# EAGLE schematic eTapper1main54 (EAGLE 8.5.2)
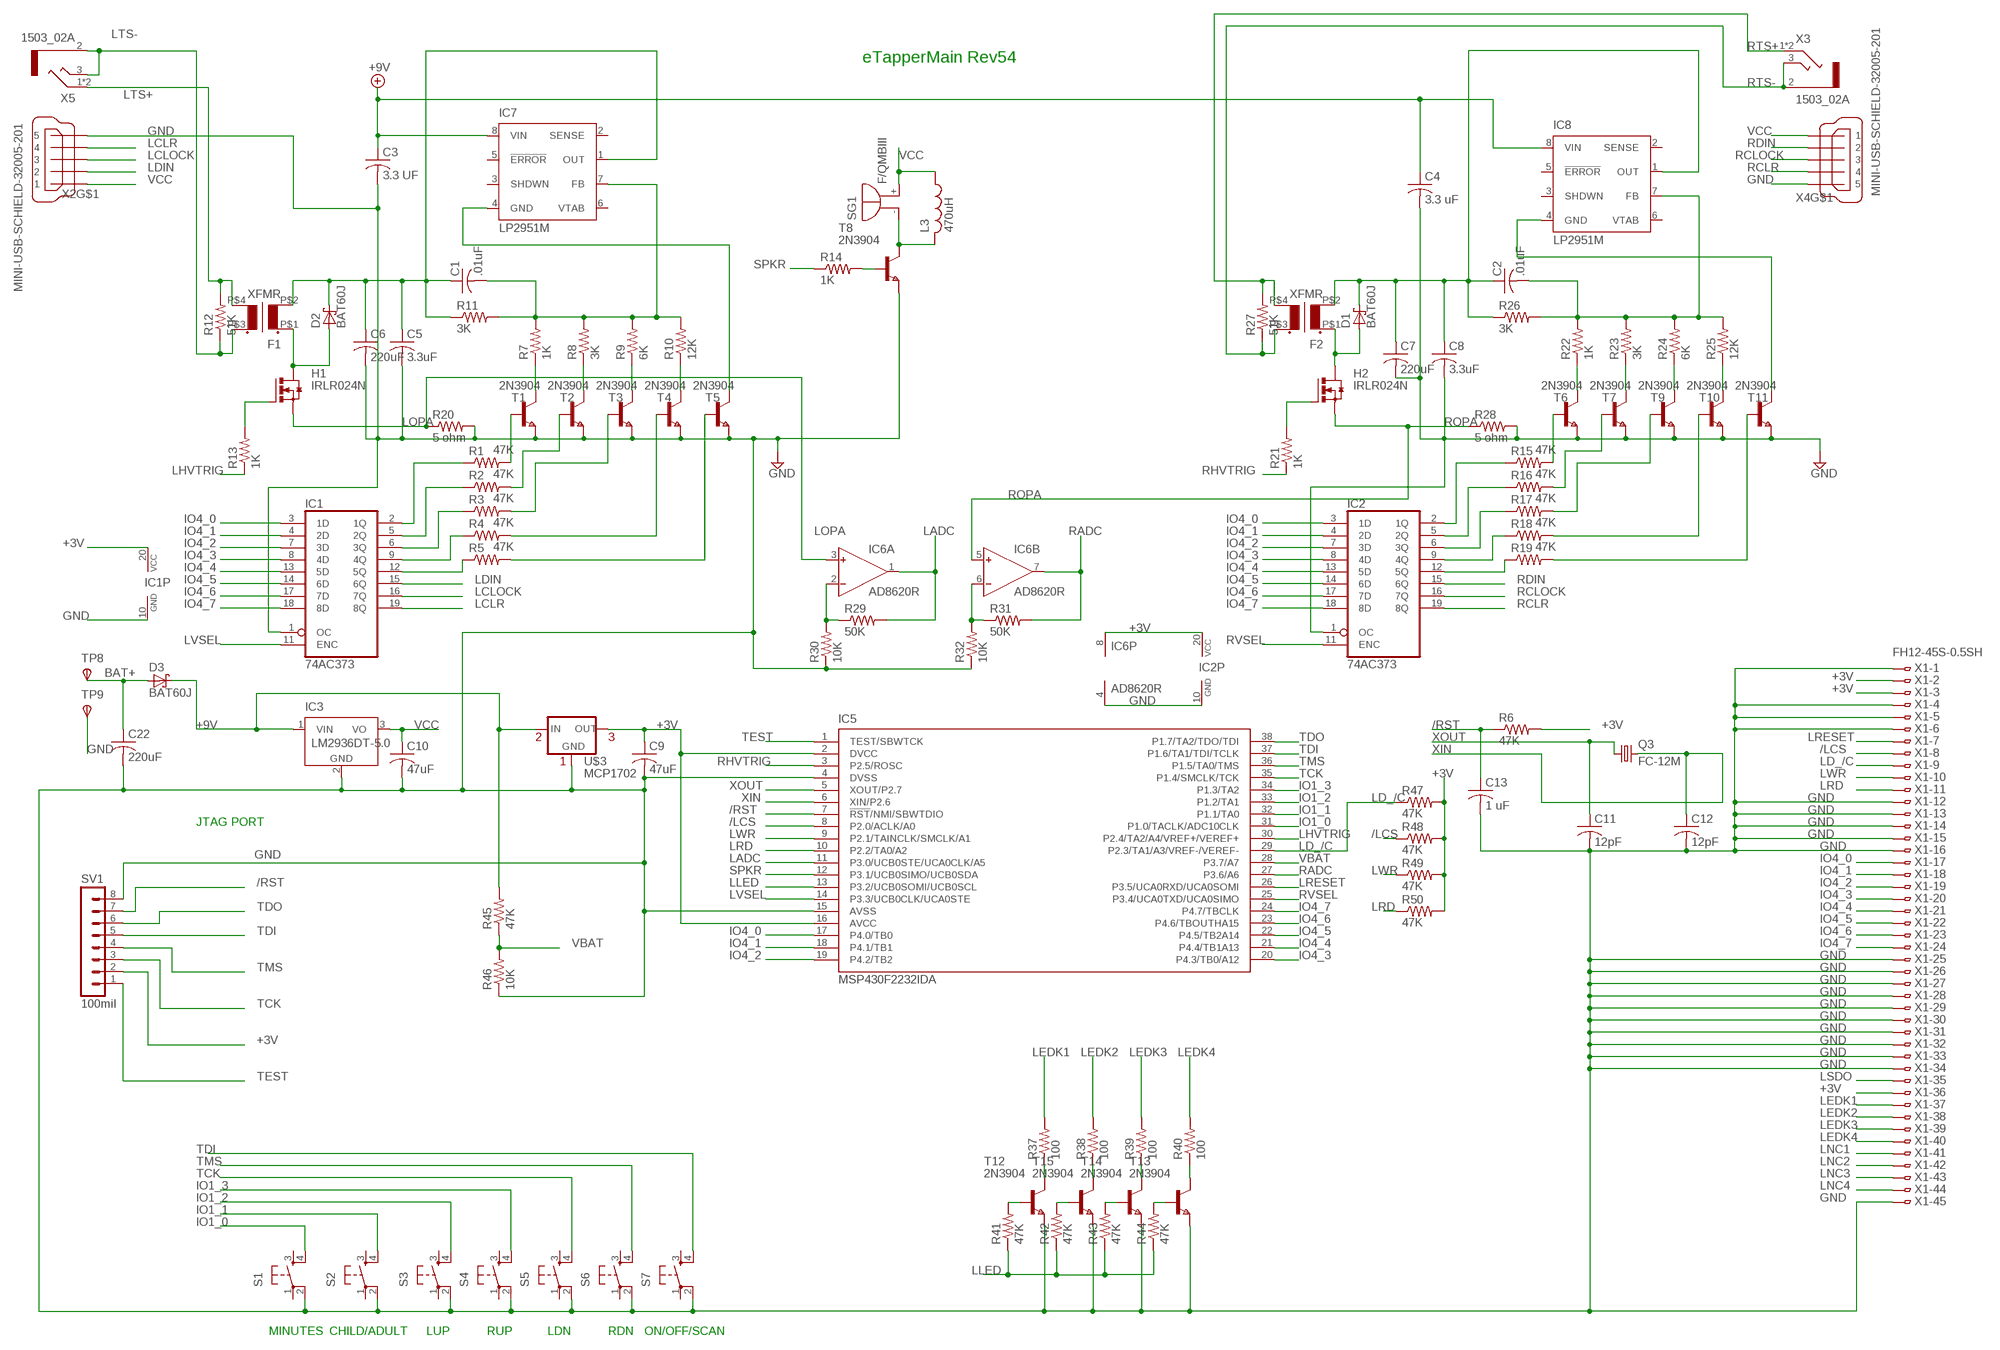
[diagram p0: schematic, sheet 1]

## Parts
C1  .01uF  C-USC0805  [C0805]
C2  .01uF  C-USC0805  [C0805]
C3  3.3 UF  C-USC1206  [C1206]
C4  3.3 uF  C-USC1206  [C1206]
C5  3.3uF  C-USC0805  [C0805]
C6  220uF  C-USC1206  [C1206]
C7  220uF  C-USC1206  [C1206]
C8  3.3uF  C-USC0805  [C0805]
C9  47uF  C-USC1206  [C1206]
C10  47uF  C-USC1206  [C1206]
C11  12pF  C-USC0805  [C0805]
C12  12pF  C-USC0805  [C0805]
C13  1 uF  C-USC0805  [C0805]
C22  220uF  C-USC1206  [C1206]
D1  BAT60J  [SOD323_ST]
D2  BAT60J  [SOD323_ST]
D3  BAT60J  [SOD323_ST]
F1  XFMR  [XFMR]
F2  XFMR  [XFMR]
H1  IRLR024N  [D-PAK_TO252AA]
H2  IRLR024N  [D-PAK_TO252AA]
IC1  74AC373  [SO20]
IC2  74AC373  [SO20]
IC3  LM2936DT-5.0  [TO252]
IC5  MSP430F2232IDA  [TSSOP38_R-PDSO-G38-DA]
IC6  AD8620R  [SO8]
IC7  LP2951M  [SO08]
IC8  LP2951M  [SO08]
L3  470uH  L-USL2825P  [L2825P]
Q3  FC-12M  [FC-12M]
R1  47K  R-US_R0603  [R0603]
R2  47K  R-US_R0603  [R0603]
R3  47K  R-US_R0603  [R0603]
R4  47K  R-US_R0603  [R0603]
R5  47K  R-US_R0603  [R0603]
R6  47K  R-US_R0603  [R0603]
R7  1K  R-US_R0603  [R0603]
R8  3K  R-US_R0603  [R0603]
R9  6K  R-US_R0603  [R0603]
R10  12K  R-US_R0603  [R0603]
R11  3K  R-US_R0603  [R0603]
R12  51K  R-US_R0603  [R0603]
R13  1K  R-US_R0603  [R0603]
R14  1K  R-US_R0603  [R0603]
R15  47K  R-US_R0603  [R0603]
R16  47K  R-US_R0603  [R0603]
R17  47K  R-US_R0603  [R0603]
R18  47K  R-US_R0603  [R0603]
R19  47K  R-US_R0603  [R0603]
R20  5 ohm  R-US_R0603  [R0603]
R21  1K  R-US_R0603  [R0603]
R22  1K  R-US_R0603  [R0603]
R23  3K  R-US_R0603  [R0603]
R24  6K  R-US_R0603  [R0603]
R25  12K  R-US_R0603  [R0603]
R26  3K  R-US_R0603  [R0603]
R27  51K  R-US_R0603  [R0603]
R28  5 ohm  R-US_R0603  [R0603]
R29  50K  R-US_R0603  [R0603]
R30  10K  R-US_R0603  [R0603]
R31  50K  R-US_R0603  [R0603]
R32  10K  R-US_R0603  [R0603]
R37  100  R-US_R0603  [R0603]
R38  100  R-US_R0603  [R0603]
R39  100  R-US_R0603  [R0603]
R40  100  R-US_R0603  [R0603]
R41  47K  R-US_R0603  [R0603]
R42  47K  R-US_R0603  [R0603]
R43  47K  R-US_R0603  [R0603]
R44  47K  R-US_R0603  [R0603]
R45  47K  R-US_R0603  [R0603]
R46  10K  R-US_R0603  [R0603]
R47  47K  R-US_R0603  [R0603]
R48  47K  R-US_R0603  [R0603]
R49  47K  R-US_R0603  [R0603]
R50  47K  R-US_R0603  [R0603]
S1  10-XX  [B3F-10XX]
S2  10-XX  [B3F-10XX]
S3  10-XX  [B3F-10XX]
S4  10-XX  [B3F-10XX]
S5  10-XX  [B3F-10XX]
S6  10-XX  [B3F-10XX]
S7  10-XX  [B3F-10XX]
SG1  F/QMBIII  [F/QMBIII]
SV1  100mil  MA08-1  [MA08-1]
T1  2N3904  NPNSOT23  [SOT-23]
T2  2N3904  NPNSOT23  [SOT-23]
T3  2N3904  NPNSOT23  [SOT-23]
T4  2N3904  NPNSOT23  [SOT-23]
T5  2N3904  NPNSOT23  [SOT-23]
T6  2N3904  NPNSOT23  [SOT-23]
T7  2N3904  NPNSOT23  [SOT-23]
T8  2N3904  NPNSOT23  [SOT-23]
T9  2N3904  NPNSOT23  [SOT-23]
T10  2N3904  NPNSOT23  [SOT-23]
T11  2N3904  NPNSOT23  [SOT-23]
T12  2N3904  NPNSOT23  [SOT-23]
T13  2N3904  NPNSOT23  [SOT-23]
T14  2N3904  NPNSOT23  [SOT-23]
T15  2N3904  NPNSOT23  [SOT-23]
TP8  TPSPAD1-20  [P1-20]
TP9  TPSPAD1-20  [P1-20]
U$3  MCP1702  [TO92-]
X1  FH12-45S-0.5SH  [FH12-45S-0.5SH]
X2  MINI-USB-SCHIELD-32005-201  [32005-201]
X3  1503_02A  [1503_02]
X4  MINI-USB-SCHIELD-32005-201  [32005-201]
X5  1503_02A  [1503_02]

## Nets
+3V [+3V]: C9.1 IC1.20(VCC) IC2.20(VCC) IC5.2(DVCC) IC5.16(AVCC) IC6.8(P:V+) R6.2 R47.2 R48.2 R49.2 R50.2 SV1.2 U$3.3(OUT) X1.2 X1.3 X1.36
+9V [+9V]: C3.1 C4.1 D3.C IC3.1(VIN) IC7.8(VIN) IC8.8(VIN) R45.2 U$3.2(IN)
/LCS: IC5.8(P2.0/ACLK/A0) R48.1 X1.8
/RST: C13.1 IC5.7(!RST!/NMI/SBWTDIO) R6.1 SV1.7
BAT+ [BAT+]: C22.1 D3.A TP8.TP(PP)
GND [GND]: C3.2 C4.2 C5.2 C6.2 C7.2 C8.2 C9.2 C10.2 C11.2 C12.2 C13.2 C22.2 IC1.1(OC) IC1.10(GND) IC2.1(OC) IC2.10(GND) IC3.2(GND) IC5.4(DVSS) IC5.15(AVSS) IC6.4(P:V-) R20.2 R28.2 R30.1 R32.1 R46.1 S1.2(P1) S2.2(P1) S3.2(P1) S4.2(P1) S5.2(P1) S6.2(P1) S7.2(P1) SV1.8 T1.2(E) T2.2(E) T3.2(E) T4.2(E) T5.2(E) T6.2(E) T7.2(E) T8.2(E) T9.2(E) T10.2(E) T11.2(E) T12.2(E) T13.2(E) T14.2(E) T15.2(E) TP9.TP(PP) U$3.1(GND) X1.1 X1.4 X1.5 X1.6 X1.12 X1.13 X1.14 X1.15 X1.16 X1.25 X1.26 X1.27 X1.28 X1.29 X1.30 X1.31 X1.32 X1.33 X1.34 X1.45 X2.5 X4.5
IO1_0: IC5.31(P1.0/TACLK/ADC10CLK) S1.4(S1)
IO1_1: IC5.32(P1.1/TA0) S2.4(S1)
IO1_2: IC5.33(P1.2/TA1) S3.4(S1)
IO1_3: IC5.34(P1.3/TA2) S4.4(S1)
IO4_0: IC1.3(1D) IC2.3(1D) IC5.17(P4.0/TB0) X1.17
IO4_1: IC1.4(2D) IC2.4(2D) IC5.18(P4.1/TB1) X1.18
IO4_2: IC1.7(3D) IC2.7(3D) IC5.19(P4.2/TB2) X1.19
IO4_3: IC1.8(4D) IC2.8(4D) IC5.20(P4.3/TB0/A12) X1.20
IO4_4: IC1.13(5D) IC2.13(5D) IC5.21(P4.4/TB1A13) X1.21
IO4_5: IC1.14(6D) IC2.14(6D) IC5.22(P4.5/TB2A14) X1.22
IO4_6: IC1.17(7D) IC2.17(7D) IC5.23(P4.6/TBOUTHA15) X1.23
IO4_7: IC1.18(8D) IC2.18(8D) IC5.24(P4.7/TBCLK) X1.24
LADC: IC5.11(P3.0/UCB0STE/UCA0CLK/A5) IC6.1(A:OUT) R29.2
LCLOCK: IC1.16(7Q) X2.3
LCLR: IC1.19(8Q) X2.4
LD_/C: IC5.29(P2.3/TA1/A3/VREF-/VEREF-) R47.1 X1.9
LDIN: IC1.15(6Q) X2.2
LEDK1: R37.2 X1.37
LEDK2: R38.2 X1.38
LEDK3: R39.2 X1.39
LEDK4: R40.2 X1.40
LHVTRIG: IC5.30(P2.4/TA2/A4/VREF+/VEREF+) R13.1
LLED: IC5.13(P3.2/UCB0SOMI/UCB0SCL) R41.1 R42.1 R43.1 R44.1
LNC1: X1.41
LNC2: X1.42
LNC3: X1.43
LNC4: X1.44
LOPA: H1.3(S) IC6.3(A:IN+) R20.1
LRD: IC5.10(P2.2/TA0/A2) R50.1 X1.11
LRESET: IC5.26(P3.5/UCA0RXD/UCA0SOMI) X1.7
LSDO: X1.35
LTS+: F1.P$4(S2) R12.2 X5.1 X5.4
LTS-: F1.P$3(S1) R12.1 X5.2 X5.3
LVSEL: IC1.11(ENC) IC5.14(P3.3/UCB0CLK/UCA0STE)
LWR: IC5.9(P2.1/TAINCLK/SMCLK/A1) R49.1 X1.10
N$1: IC1.2(1Q) R1.1
N$2: IC1.5(2Q) R2.1
N$3: IC1.6(3Q) R3.1
N$4: IC1.9(4Q) R4.1
N$5: IC1.12(5Q) R5.1
N$6: L3.2 SG1.-(+) T8.1(C)
N$7: R4.2 T4.3(B)
N$8: R5.2 T5.3(B)
N$9: D2.A F1.P$1(P1) H1.4(D)
N$10: R7.1 T1.1(C)
N$11: R8.1 T2.1(C)
N$12: R9.1 T3.1(C)
N$13: R1.2 T1.3(B)
N$14: R2.2 T2.3(B)
N$15: R3.2 T3.3(B)
N$16: R10.1 T4.1(C)
N$17: C1.2 IC7.7(FB) R7.2 R8.2 R9.2 R10.2 R11.2
N$18: C1.1 C5.1 C6.1 D2.C F1.P$2(P2) IC7.1(OUT) R11.1
N$19: D1.A F2.P$1(P1) H2.4(D)
N$20: IC2.2(1Q) R15.1
N$21: H1.1(G) R13.2
N$22: R14.2 T8.3(B)
N$24: IC2.5(2Q) R16.1
N$25: IC2.6(3Q) R17.1
N$26: IC2.9(4Q) R18.1
N$27: IC2.12(5Q) R19.1
N$28: R44.2 T13.3(B)
N$29: R15.2 T6.3(B)
N$30: R16.2 T7.3(B)
N$31: R17.2 T9.3(B)
N$32: R18.2 T10.3(B)
N$33: R19.2 T11.3(B)
N$35: R22.1 T6.1(C)
N$36: R23.1 T7.1(C)
N$37: R24.1 T9.1(C)
N$38: R25.1 T10.1(C)
N$39: C2.2 IC8.7(FB) R22.2 R23.2 R24.2 R25.2 R26.2
N$40: C2.1 C7.1 C8.1 D1.C F2.P$2(P2) IC8.1(OUT) R26.1
N$41: R37.1 T12.1(C)
N$42: H2.1(G) R21.2
N$43: R38.1 T15.1(C)
N$44: R39.1 T14.1(C)
N$45: IC7.4(GND) T5.1(C)
N$46: R40.1 T13.1(C)
N$47: IC8.4(GND) T11.1(C)
N$48: R43.2 T14.3(B)
N$49: R41.2 T12.3(B)
N$50: R42.2 T15.3(B)
N$52: IC6.6(B:IN-) R31.1 R32.2
N$54: IC6.2(A:IN-) R29.1 R30.2
RADC: IC5.27(P3.6/A6) IC6.7(B:OUT) R31.2
RCLOCK: IC2.16(7Q) X4.3
RCLR: IC2.19(8Q) X4.4
RDIN: IC2.15(6Q) X4.2
RHVTRIG: IC5.3(P2.5/ROSC) R21.1
ROPA: H2.3(S) IC6.5(B:IN+) R28.1
RTS+: F2.P$4(S2) R27.2 X3.1 X3.4
RTS-: F2.P$3(S1) R27.1 X3.2 X3.3
RVSEL: IC2.11(ENC) IC5.25(P3.4/UCA0TXD/UCA0SIMO)
SPKR: IC5.12(P3.1/UCB0SIMO/UCB0SDA) R14.1
TCK: IC5.35(P1.4/SMCLK/TCK) S5.4(S1) SV1.3
TDI: IC5.37(P1.6/TA1/TDI/TCLK) S7.4(S1) SV1.5
TDO: IC5.38(P1.7/TA2/TDO/TDI) SV1.6
TEST: IC5.1(TEST/SBWTCK) SV1.1
TMS: IC5.36(P1.5/TA0/TMS) S6.4(S1) SV1.4
VBAT: IC5.28(P3.7/A7) R45.1 R46.2
VCC [VCC]: C10.1 IC3.3(VO) L3.1 SG1.+(-) X2.1 X4.1
XIN: C12.1 IC5.6(XIN/P2.6) Q3.2
XOUT: C11.1 IC5.5(XOUT/P2.7) Q3.1
Unconnected: IC7.2(SENSE) IC7.3(SHDWN) IC7.5(!ERROR) IC7.6(VTAB) IC8.2(SENSE) IC8.3(SHDWN) IC8.5(!ERROR) IC8.6(VTAB) S1.1(P) S1.3(S) S2.1(P) S2.3(S) S3.1(P) S3.3(S) S4.1(P) S4.3(S) S5.1(P) S5.3(S) S6.1(P) S6.3(S) S7.1(P) S7.3(S) X2.M1(S:S1) X2.M2(S:S2) X2.M3(S:S3) X2.M4(S:S4) X4.M1(S:S1) X4.M2(S:S2) X4.M3(S:S3) X4.M4(S:S4)

## Notes on the sheet
- eTapperMain Rev54
- JTAG PORT
- MINUTES | CHILD/ADULT | LUP | RUP | LDN | RDN | ON/OFF/SCAN

## Library data of the parts
C1-C13 C22 = rcl:C-US: CAPACITOR, American symbol; SPICEPREFIX: C
D1-D3 = diode:BAT60J: Schottky barrier diode Source: www.st.com, BAT60J.pdf
F1 F2 = XFMR1:XFMR: Transformer 1"X1" 0.4"X0.4" hole separation for e_tapper
H1 H2 = IRLR024N:IRLR024N: IRLR024N HEXFET Power Mosfet N channel Infeneon Technology TO-251AA IPAK
IC1 IC2 = 74373_SO20:74*373: Octal D type transparent LATCH, edge triggered
IC3 = national-semiconductor:LM2936?*: Ultra-Low Quiescent Current LDO Voltage Regulator Source: Data sheet <http://www.national.com/ds/LM/LM2936.pdf>; MF: NATIONAL SEMICONDUCTOR; MPN: LM2936DT-5.0/NOPB; OC_FARNELL: 1286864; OC_NEWARK: 41K4501
IC5 = texas:MSP430F22*2IDA: MIXED SIGNAL MICROCONTROLLER Source: http://focus.ti.com/lit/ds/symlink/msp430f2274.pdf; MPN: MSP430F2232IDA; OC_FARNELL: 1610178; OC_NEWARK: 28M6312
IC6 = analog-devices:AD8620: Precision, Very Low Noise, Low Input Bias Current, Wide Bandwidth JFET Operational Amplifiers Source: http://www.analog.com/static/imported-files/data_sheets/AD8610_8620.pdf; MF: ALTERA CORPORATION; MPN: AD8620ARZ; OC_FARNELL: 9994386; OC_NEWARK: 59K6972
IC7 IC8 = national-semiconductor:LP2951: Adjustable Micropower Voltage Regulator Source: http://www.national.com/ds/LP/LP2950.pdf; MF: FAIRCHILD SEMICONDUCTOR; MPN: LP2951CM; OC_FARNELL: 9488561; OC_NEWARK: 78K6014
L3 = rcl:L-US: INDUCTOR, American symbol; SPICEPREFIX: L
Q3 = crystal:FC-12M: kHz RANGE CRYSTAL UNIT LOW PROFILE SMD Source: Epson Toyocom FC-12M.pdf
R1-R32 R37-R50 = resistor:R-US_: RESISTOR, American symbol
S1-S7 = switch-omron:10-XX: OMRON SWITCH; MPN: B3F-1000; OC_FARNELL: 176432; OC_NEWARK: 36M3542
SG1 = buzzer:F/QMBIII: BUZZER Source: Buerklin; OC_FARNELL: unknown; OC_NEWARK: unknown
SV1 = con-lstb:MA08-1: PIN HEADER; OC_FARNELL: unknown; OC_NEWARK: unknown
T1-T15 = zetex:NPNSOT23: NPN TRANSISTOR; MPN: DSS20201L-7; OC_FARNELL: 1710688; OC_NEWARK: 25R4555
TP8 TP9 = testpad:TPS: TEST PIN
U$3 = mcp1702:MCP1702: MCP1702 LDO Fixed Voltage regulator
X1 = con-hirose:FH12-45S-0.5S: 0.5mm Pitch Connectors For FPC/FFC Source: Data sheet <http://www.hirose.co.jp/cataloge_hp/e58605370.pdf>; OC_FARNELL: unknown; OC_NEWARK: unknown
X2 X4 = con-cypressindustries:MINI-USB-SCHIELD-: MINI USB-B Conector Source: www.cypressindustries.com; OC_FARNELL: unknown; OC_NEWARK: unknown
X3 X5 = 1503_02Astereojacks:1503_02A

## Module LP2951
Ports: 

### Library data of the parts

## Net classes
1 GND: width 0.305 mm, clearance 0.152 mm
2 BAT+: width 0.305 mm, clearance 0.152 mm
3 +9V: width 0.305 mm, clearance 0.152 mm
4 +3V: width 0.305 mm, clearance 0.152 mm
5 VCC: width 0.305 mm, clearance 0.152 mm